# EasyEDA Pro project 三路报警电路设计.eprj

# Schematic 数据选择器
Board Name: Board1; Create Date: 2025-05-18; Page Name: P1; Project Name: 数据选择器; Schematic Name: 数据选择器; Update Date: 2025-05-19; Company: 嘉立创EDA; Page Size: A4; Version: V1.0
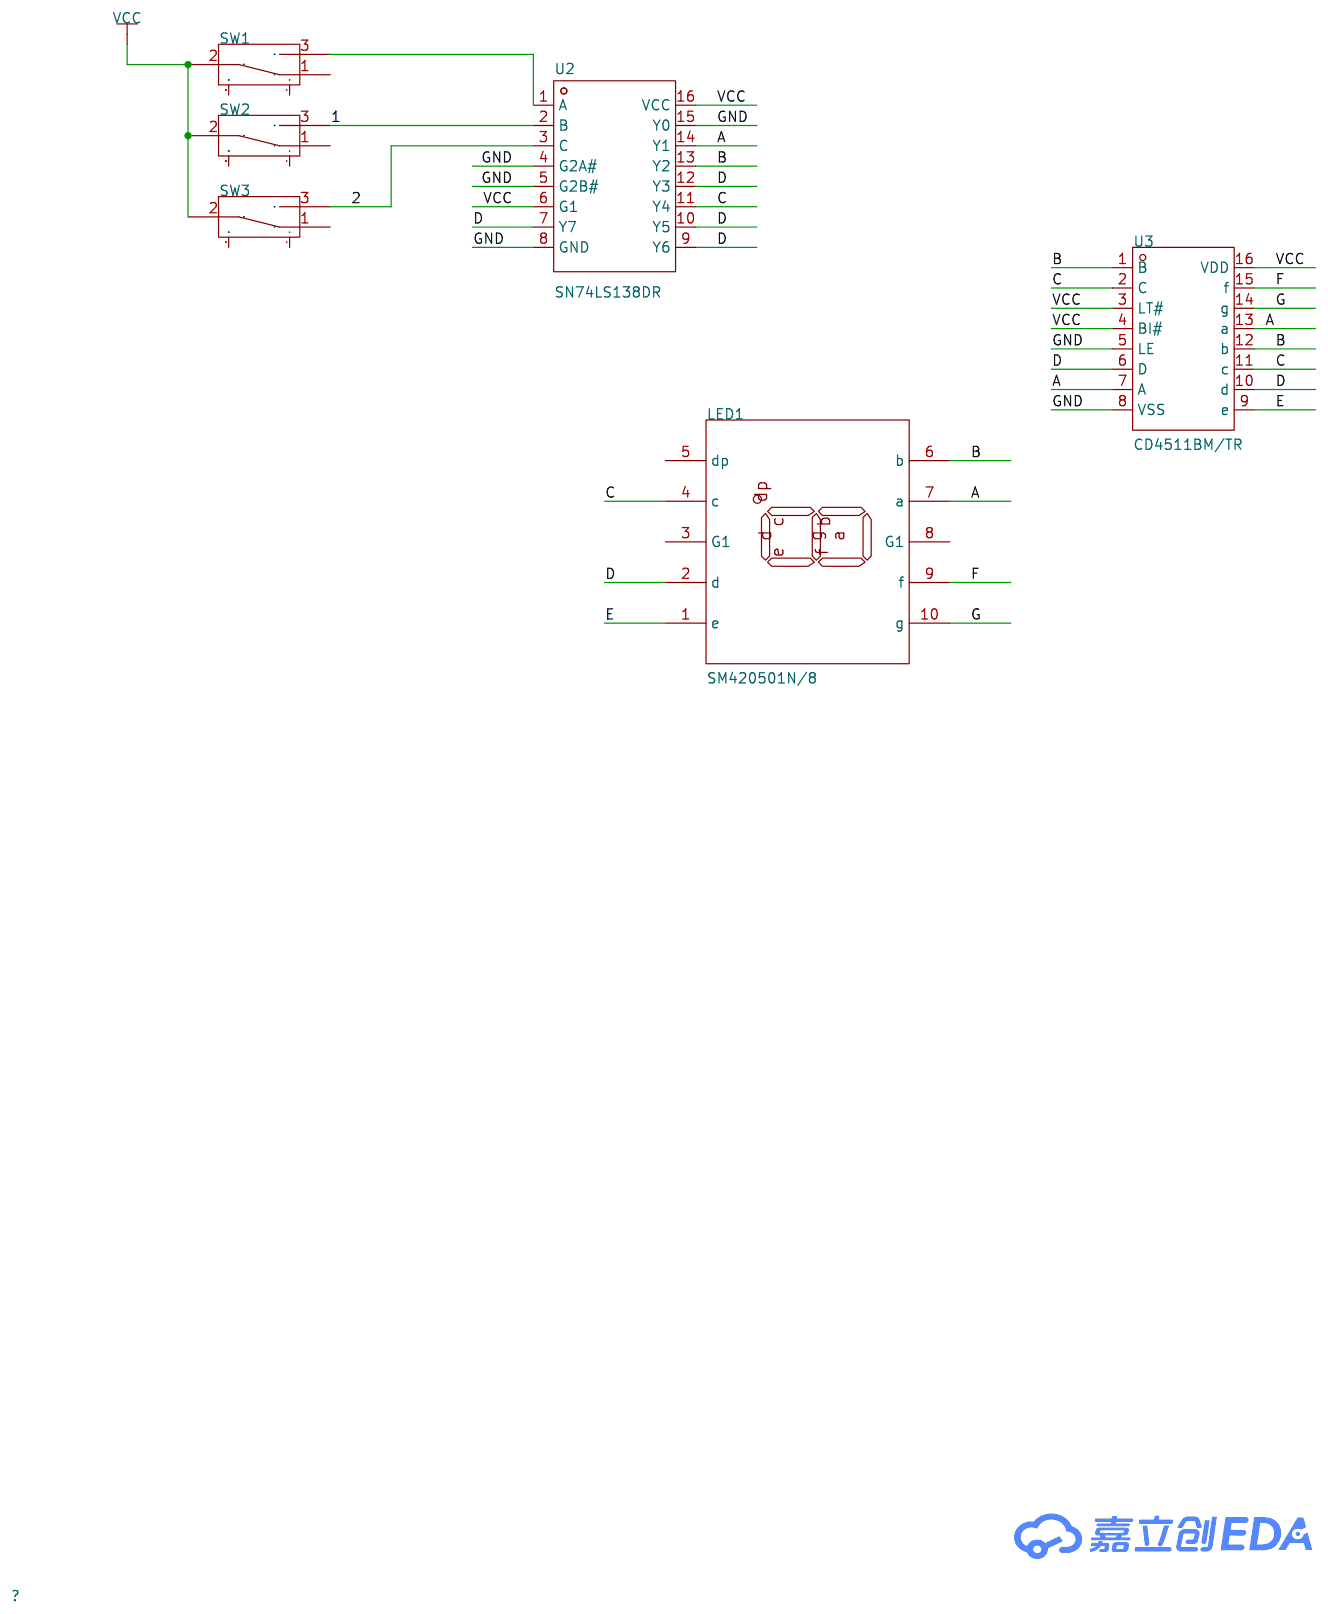
[diagram p0: schematic sheet]

## Parts
LED1  SM420501N/8  [LED-SEG-TH_10P-L12.7-W19.0-P2.54-S15.24-BL]
SW1  -  [拨动开关_侧]
SW2  -  [拨动开关_侧]
SW3  -  [拨动开关_侧]
U2  SN74LS138DR  [SOIC-16_L9.9-W3.9-P1.27-LS6.0-BL]
U3  CD4511BM/TR  [SOP-16_L10.0-W3.9-P1.27-LS6.0-BL]

## Library data of the parts
LED1 = SM420501N/8: 数码管位数:1位;发光颜色:红色;LED极性:共阴极;数字/字母大小(英寸):0.5;; LCSC Part Name: 1位0.5英寸红色数码管 共阴极; Supplier Part: C252201; Manufacturer: ARKLED(方舟); Supplier Footprint: 插件; JLCPCB Part Class: 扩展库; Datasheet: https://atta.szlcsc.com/upload/public/pdf/source/20180821/C252201_1E0130B228B09D4E21858CDC1E7784AB.pdf; Supplier: LCSC; Number of Characters: 1位; Luminous Color: 红色; LED Polarity: 共阴极; Digit/Alpha Size(inch): 0.5
SW1-SW3 = 拨动开关_侧: Supplier Footprint: 插件
U2 = SN74LS138DR: 工作电压:4.75V~5.25V;灌电流(IOL):8mA;拉电流(IOH):-;; Supplier Part: C7736; Manufacturer: TI(德州仪器); Supplier Footprint: SOIC-16; JLCPCB Part Class: 扩展库; Datasheet: https://www.ti.com/cn/lit/gpn/sn74ls138; Supplier: LCSC; Type: 解码器/多路分解器; Voltage Supply Source: 单电源; Voltage - Supply: 4.75V~5.25V; Current - Output Low(IOL): 8mA; Operating temperature: 0℃~+70℃
U3 = CD4511BM/TR: Supplier Part: C356693; Manufacturer: HGSEMI(华冠); Supplier Footprint: SOP-16; JLCPCB Part Class: 扩展库; Datasheet: https://atta.szlcsc.com/upload/public/pdf/source/20190510/C356693_9A8833065064A1742F4CF713C63B74A7.pdf; Supplier: LCSC

## Nets
GND: U2.4(G2A#) U2.5(G2B#) U2.8(GND) U2.15(Y0) U3.5(LE) U3.8(VSS)
VCC: SW1.2 SW2.2 SW3.2 U2.6(G1) U2.16(VCC) U3.3(LT#) U3.4(BI#) U3.16(VDD)
1: SW2.3 U2.2(B)
2: SW3.3 U2.3(C)
A: LED1.7(a) U2.14(Y1) U3.7(A) U3.13(a)
B: LED1.6(b) U2.13(Y2) U3.1(B) U3.12(b)
C: LED1.4(c) U2.11(Y4) U3.2(C) U3.11(c)
D: LED1.2(d) U2.7(Y7) U2.9(Y6) U2.10(Y5) U2.12(Y3) U3.6(D) U3.10(d)
E: LED1.1(e) U3.9(e)
F: LED1.9(f) U3.15(f)
G: LED1.10(g) U3.14(g)
Net-(SW1-3): SW1.3 U2.1(A)

Not connected (* = marked no-connect by the designer): LED1 3(G1) 5(dp) 8(G1); SW1 1 4 5; SW2 1 4 5; SW3 1 4 5
